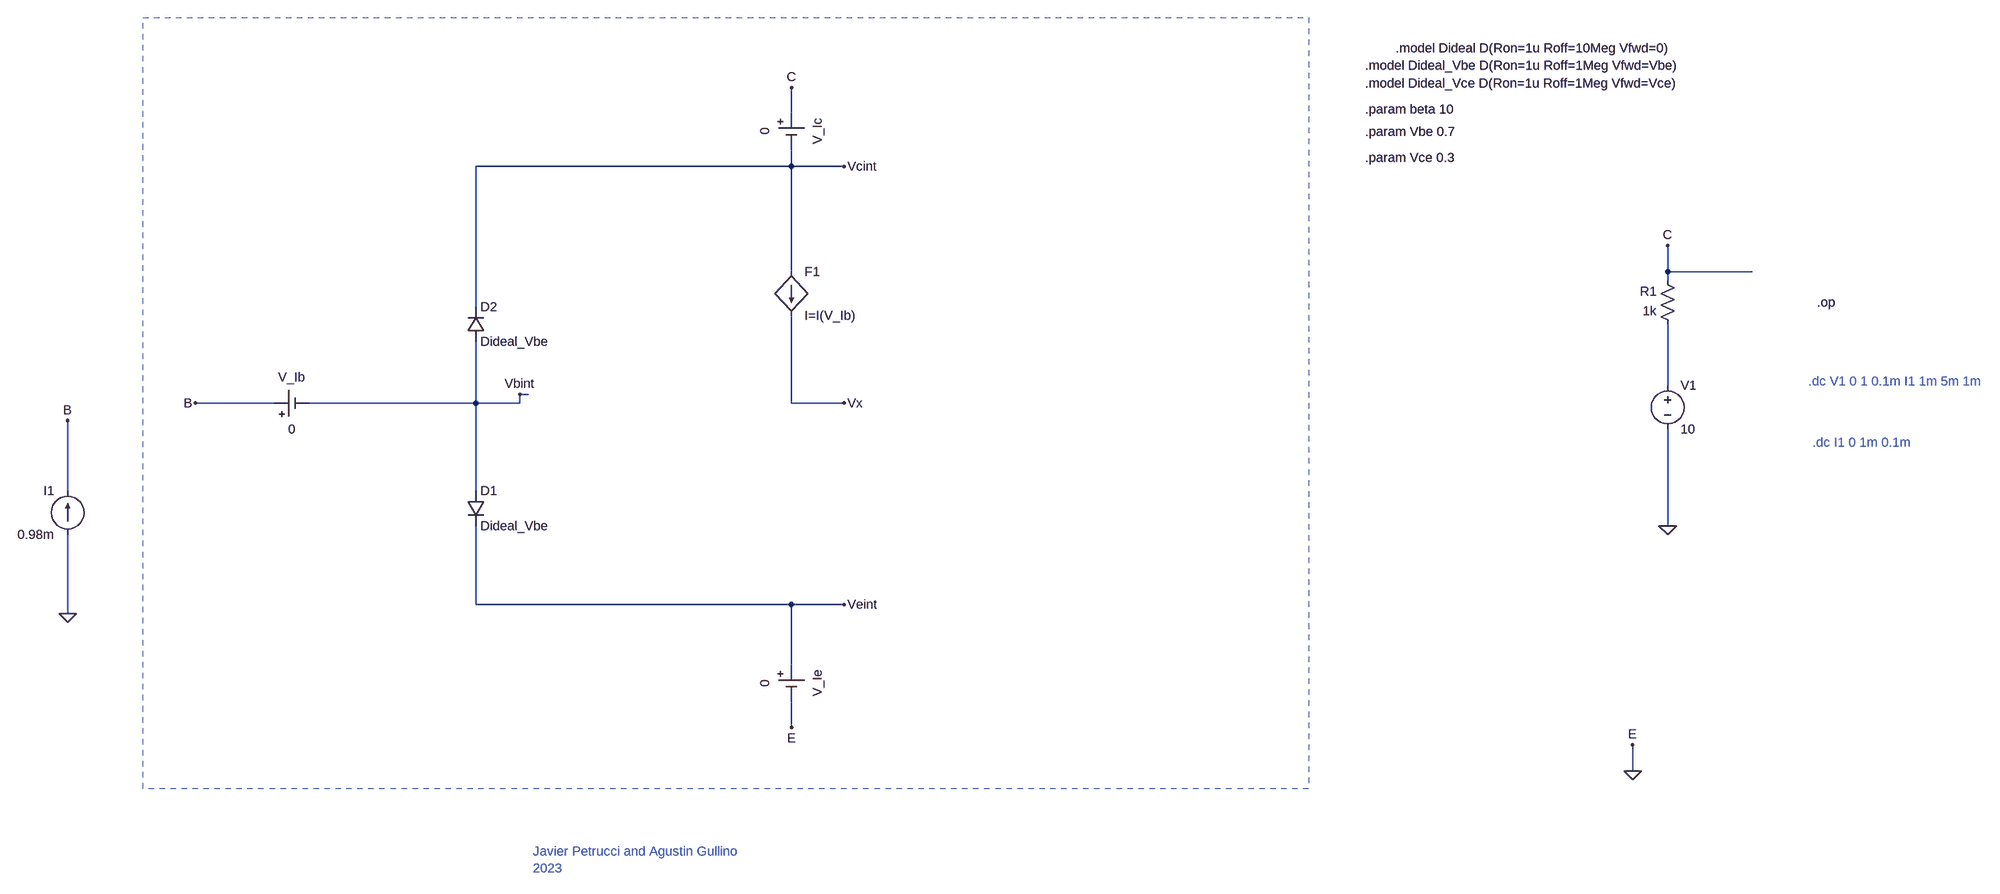
[diagram p0: schematic Draft1.asc]
Draft1.asc, the LTspice schematic file:
Version 4
SHEET 1 2224 804
WIRE -96 -608 -96 -656
WIRE -96 -512 -96 -544
WIRE -96 -512 -672 -512
WIRE 0 -512 -96 -512
WIRE -96 -320 -96 -512
WIRE 1600 -320 1600 -368
WIRE 1776 -320 1600 -320
WIRE 1600 -304 1600 -320
WIRE -672 -256 -672 -512
WIRE 1600 -112 1600 -224
WIRE -576 -96 -592 -96
WIRE -1040 -80 -1184 -80
WIRE -672 -80 -672 -192
WIRE -672 -80 -976 -80
WIRE -592 -80 -592 -96
WIRE -592 -80 -672 -80
WIRE -96 -80 -96 -240
WIRE 0 -80 -96 -80
WIRE -1424 80 -1424 -48
WIRE -672 80 -672 -80
WIRE 1600 144 1600 -32
WIRE -672 288 -672 144
WIRE -96 288 -672 288
WIRE 0 288 -96 288
WIRE -1424 304 -1424 160
WIRE -96 400 -96 288
WIRE -96 512 -96 464
WIRE 1536 592 1536 544
FLAG -1424 304 0
FLAG 1600 144 0
FLAG 1536 592 0
FLAG 1536 544 E
FLAG 1600 -368 C
FLAG -1184 -80 B
FLAG -96 512 E
FLAG -96 -656 C
FLAG 0 -512 Vcint
FLAG 0 -80 Vx
FLAG 0 288 Veint
FLAG -592 -96 Vbint
FLAG -1424 -48 B
DATAFLAG -880 -80 ""
DATAFLAG 80 384 "I(V_ie)"
DATAFLAG 80 -640 "I(V_ic)"
DATAFLAG -1120 -80 "I(V_ib)"
DATAFLAG 1728 -320 ""
DATAFLAG -272 288 ""
DATAFLAG 272 -64 "V(vcent)"
DATAFLAG 256 -512 "V(vcint)"
DATAFLAG 272 288 "V(veint)"
SYMBOL current -1424 160 R180
WINDOW 0 24 80 Left 2
WINDOW 3 24 0 Left 2
WINDOW 123 0 0 Left 0
WINDOW 39 0 0 Left 0
SYMATTR InstName I1
SYMATTR Value 0.98m
SYMBOL voltage 1600 -128 R0
WINDOW 123 0 0 Left 0
WINDOW 39 0 0 Left 0
SYMATTR InstName V1
SYMATTR Value 10
SYMBOL diode -688 80 R0
SYMATTR InstName D1
SYMATTR Value Dideal_Vbe
SYMBOL diode -688 -192 M180
WINDOW 0 24 64 Left 2
WINDOW 3 24 0 Left 2
SYMATTR InstName D2
SYMATTR Value Dideal_Vbe
SYMBOL Misc\\cell -96 400 R0
WINDOW 0 32 32 VTop 2
WINDOW 3 -32 32 VBottom 2
WINDOW 123 0 0 Left 0
WINDOW 39 0 0 Left 0
SYMATTR InstName V_Ie
SYMATTR Value 0
SYMBOL Misc\\cell -96 -608 R0
WINDOW 0 32 32 VTop 2
WINDOW 3 -32 32 VBottom 2
WINDOW 123 0 0 Left 0
WINDOW 39 0 0 Left 0
SYMATTR InstName V_Ic
SYMATTR Value 0
SYMBOL Misc\\cell -1040 -80 R270
WINDOW 0 32 32 VTop 2
WINDOW 3 -32 32 VBottom 2
WINDOW 123 0 0 Left 0
WINDOW 39 0 0 Left 0
SYMATTR InstName V_Ib
SYMATTR Value 0
SYMBOL res 1616 -208 R180
WINDOW 0 36 76 Left 2
WINDOW 3 36 40 Left 2
SYMATTR InstName R1
SYMATTR Value 1k
SYMBOL f -96 -320 R0
SYMATTR InstName F1
SYMATTR Value I=I(V_Ib)
TEXT 1880 -120 Left 2 ;.dc V1 0 1 0.1m I1 1m 5m 1m
TEXT 1888 -8 Left 2 ;.dc I1 0 1m 0.1m
TEXT 1896 -264 Left 2 !.op
TEXT 1048 -696 Left 2 !.model Dideal_Vbe D(Ron=1u Roff=1Meg Vfwd=Vbe)
TEXT 1104 -728 Left 2 !.model Dideal D(Ron=1u Roff=10Meg Vfwd=0)
TEXT 1048 -616 Left 2 !.param beta 10
TEXT -568 760 Left 2 ;Javier Petrucci and Agustin Gullino\n2023
TEXT 1048 -664 Left 2 !.model Dideal_Vce D(Ron=1u Roff=1Meg Vfwd=Vce)
TEXT 1048 -576 Left 2 !.param Vbe 0.7
TEXT 1048 -528 Left 2 !.param Vce 0.3
RECTANGLE Normal 848 624 -1280 -784 2

The netlist it stands for:
* Draft1.asc
I1 0 B 0.98m
V1 N001 0 10
D1 Vbint Veint Dideal_Vbe
D2 Vbint Vcint Dideal_Vbe
V_Ie Veint 0 0
V_Ic C Vcint 0
V_Ib B Vbint 0
R1 N001 C 1k
F1 Vcint Vx I=I(V_Ib)
.model D D
.lib standard.dio
* .dc V1 0 1 0.1m I1 1m 5m 1m
* .dc I1 0 1m 0.1m
.op
.model Dideal_Vbe D(Ron=1u Roff=1Meg Vfwd=Vbe)
.model Dideal D(Ron=1u Roff=10Meg Vfwd=0)
.param beta 10
* Javier Petrucci and Agustin Gullino
* 2023
.model Dideal_Vce D(Ron=1u Roff=1Meg Vfwd=Vce)
.param Vbe 0.7
.param Vce 0.3
.backanno
.end